# EAGLE design PCB_MOTEUR_V0_2b (EAGLE 9.5.2)
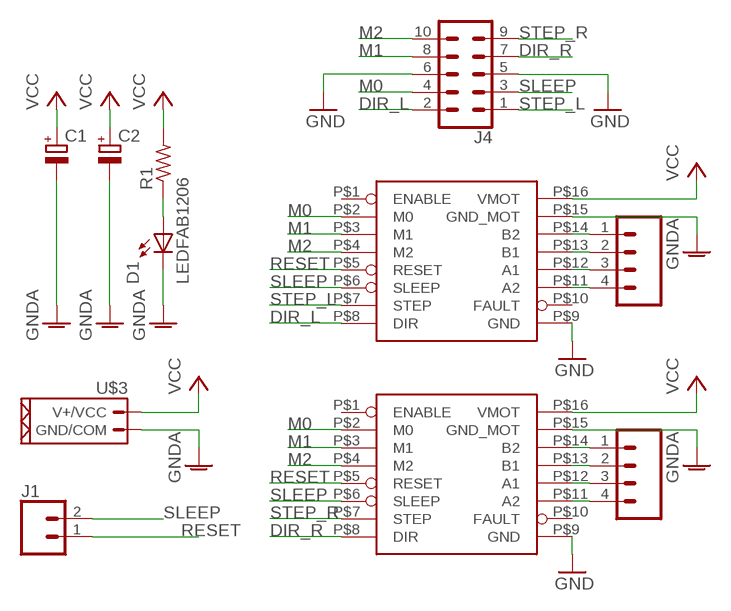
[diagram p0: schematic, sheet 1]

## Parts
C1  CPOL-EUE3.5-8  [E3,5-8]
C2  CPOL-EUE3.5-8  [E3,5-8]
D1  LEDFAB1206  [LED1206FAB]
J1  CONN_02  [1X02]
J3  CONN_04POLAR  [MOLEX-1X4]
J4  CONN_05X2SHD  [2X5-SHROUDED]
J5  CONN_04POLAR  [MOLEX-1X4]
R1  RES-US1206FAB  [R1206FAB]
U$1  DRV8825  [DRIVER_CARRIER_POLOLU_16]
U$2  DRV8825  [DRIVER_CARRIER_POLOLU_16]
U$3  CONN_02_PUIXT30  [XT30_FEMALE]

## Nets
DIR_L: J4.2 U$1.P$8(DIR)
DIR_R: J4.7 U$2.P$8(DIR)
GND: J4.5 J4.6 U$1.P$9(GND) U$2.P$9(GND)
GNDA: C1.- C2.- D1.2(C) U$1.P$15(GND_MOT) U$2.P$15(GND_MOT) U$3.P$2(GND/COM)
M0: J4.4 U$1.P$2(M0) U$2.P$2(M0)
M1: J4.8 U$1.P$3(M1) U$2.P$3(M1)
M2: J4.10 U$1.P$4(M2) U$2.P$4(M2)
N$1: J3.1 U$1.P$14(B2)
N$2: J3.2 U$1.P$13(B1)
N$3: J3.3 U$1.P$12(A1)
N$4: J3.4 U$1.P$11(A2)
N$5: D1.1(A) R1.1
N$7: J5.1 U$2.P$14(B2)
N$8: J5.2 U$2.P$13(B1)
N$9: J5.3 U$2.P$12(A1)
N$14: J5.4 U$2.P$11(A2)
RESET: J1.1 U$1.P$5(RESET) U$2.P$5(RESET)
SLEEP: J1.2 J4.3 U$1.P$6(SLEEP) U$2.P$6(SLEEP)
STEP_L: J4.1 U$1.P$7(STEP)
STEP_R: J4.9 U$2.P$7(STEP)
VCC: C1.+ C2.+ R1.2 U$1.P$16(VMOT) U$2.P$16(VMOT) U$3.P$1(V+/VCC)
Unconnected: U$1.P$1(ENABLE) U$1.P$10(FAULT) U$2.P$1(ENABLE) U$2.P$10(FAULT)

## Library data of the parts
C1 C2 = rcl:CPOL-EU: POLARIZED CAPACITOR, European symbol; SPICEPREFIX: C
D1 = fab:LED: LED
J1 = OPENBOT:CONN_02: Multi connection point. Often used as Generic Header-pin footprint for 0.1 inch spaced/style header connections On any of the 0.1 inch spaced packages, you can populate with these: Break Away Headers - Straight <https://www.sparkfun.com/products/116> (PRT-00116) Break Away Male Headers - Right Angle <https://www.sparkfun.com/products/553> (PRT-00553) Female Headers <https://www.sparkfun.com/products/115> (PRT-00115) Break Away Headers - Machine Pin <https://www.sparkfun.com/products/117> (PRT-00117) Break Away Female Headers - Swiss Machine Pin <https://www.sparkfun.com/products/743> (PRT-00743) For SCREWTERMINALS and SPRING TERMINALS visit here: Screw Terimnals on SparkFun.com <https://www.sparkfun.com/search/results?term=Screw+Terminals> (5mm/3.5mm/2.54mm spacing) This device is also useful as a general connection point to wire up your design to another part of your project. Our various solder wires solder well into these plated through hole pads. Hook-Up Wire - Assortment (Stranded, 22 AWG) <https://www.sparkfun.com/products/11375> (PRT-11375) Hook-Up Wire - Assortment (Solid Core, 22 AWG) <https://www.sparkfun.com/products/11367> (PRT-11367) View the entire wire category on our website here <https://www.sparkfun.com/categories/141> Special notes: Molex polarized connector foot print use with: PRT-08233 with associated crimp pins and housings. 2.54_SCREWTERM for use with PRT-10571. 3.5mm Screw Terminal footprints for PRT-08084 5mm Screw Terminal footprints for use with PRT-08432 Multi connection point. Often used as Generic Header-pin footprint for 0.1 inch spaced/style header connections On any of the 0.1 inch spaced packages, you can populate with these: Break Away Headers - Straight <https://www.sparkfun.com/products/116> (PRT-00116) Break Away Male Headers - Right Angle <https://www.sparkfun.com/products/553> (PRT-00553) Female Headers <https://www.sparkfun.com/products/115> (PRT-00115) Break Away Headers - Machine Pin <https://www.sparkfun.com/products/117> (PRT-00117) Break Away Female Headers - Swiss Machine Pin <https://www.sparkfun.com/products/743> (PRT-00743) For SCREWTERMINALS and SPRING TERMINALS visit here: Screw Terimnals on SparkFun.com <https://www.sparkfun.com/search/results?term=Screw+Terminals> (5mm/3.5mm/2.54mm spacing) This device is also useful as a general connection point to wire up your design to another part of your project. Our various solder wires solder well into these plated through hole pads. Hook-Up Wire - Assortment (Stranded, 22 AWG) <https://www.sparkfun.com/products/11375> (PRT-11375) Hook-Up Wire - Assortment (Solid Core, 22 AWG) <https://www.sparkfun.com/products/11367> (PRT-11367) View the entire wire category on our website here <https://www.sparkfun.com/categories/141> Special notes: Molex polarized connector foot print use with: PRT-08233 with associated crimp pins and housings. 2.54_SCREWTERM for use with PRT-10571. 3.5mm Screw Terminal footprints for PRT-08084 5mm Screw Terminal footprints for use with PRT-08432
J3 J5 = OPENBOT:CONN_04: Multi connection point. Often used as Generic Header-pin footprint for 0.1 inch spaced/style header connections On any of the 0.1 inch spaced packages, you can populate with these: Break Away Headers - Straight <https://www.sparkfun.com/products/116> (PRT-00116) Break Away Male Headers - Right Angle <https://www.sparkfun.com/products/553> (PRT-00553) Female Headers <https://www.sparkfun.com/products/115> (PRT-00115) Break Away Headers - Machine Pin <https://www.sparkfun.com/products/117> (PRT-00117) Break Away Female Headers - Swiss Machine Pin <https://www.sparkfun.com/products/743> (PRT-00743) For SCREWTERMINALS and SPRING TERMINALS visit here: Screw Terimnals on SparkFun.com <https://www.sparkfun.com/search/results?term=Screw+Terminals> (5mm/3.5mm/2.54mm spacing) This device is also useful as a general connection point to wire up your design to another part of your project. Our various solder wires solder well into these plated through hole pads. Hook-Up Wire - Assortment (Stranded, 22 AWG) <https://www.sparkfun.com/products/11375> (PRT-11375) Hook-Up Wire - Assortment (Solid Core, 22 AWG) <https://www.sparkfun.com/products/11367> (PRT-11367) View the entire wire category on our website here <https://www.sparkfun.com/categories/141> Special notes: Molex polarized connector foot print use with SKU : PRT-08231 with associated crimp pins and housings. 1MM SMD Version SKU: PRT-10208 Multi connection point. Often used as Generic Header-pin footprint for 0.1 inch spaced/style header connections On any of the 0.1 inch spaced packages, you can populate with these: Break Away Headers - Straight <https://www.sparkfun.com/products/116> (PRT-00116) Break Away Male Headers - Right Angle <https://www.sparkfun.com/products/553> (PRT-00553) Female Headers <https://www.sparkfun.com/products/115> (PRT-00115) Break Away Headers - Machine Pin <https://www.sparkfun.com/products/117> (PRT-00117) Break Away Female Headers - Swiss Machine Pin <https://www.sparkfun.com/products/743> (PRT-00743) For SCREWTERMINALS and SPRING TERMINALS visit here: Screw Terimnals on SparkFun.com <https://www.sparkfun.com/search/results?term=Screw+Terminals> (5mm/3.5mm/2.54mm spacing) This device is also useful as a general connection point to wire up your design to another part of your project. Our various solder wires solder well into these plated through hole pads. Hook-Up Wire - Assortment (Stranded, 22 AWG) <https://www.sparkfun.com/products/11375> (PRT-11375) Hook-Up Wire - Assortment (Solid Core, 22 AWG) <https://www.sparkfun.com/products/11367> (PRT-11367) View the entire wire category on our website here <https://www.sparkfun.com/categories/141> Special notes: Molex polarized connector foot print use with SKU : PRT-08231 with associated crimp pins and housings. 1MM SMD Version SKU: PRT-10208; PROD_ID: CONN-08186; SF_ID: PRT-08231
J4 = OPENBOT:CONN_05X2: Multi connection point. Often used as Generic Header-pin footprint for 0.1 inch spaced/style header connections For AVR SPI programming port, see special device with nice symbol: "AVR_SPI_PROG_5x2.dev" You can populate with any combo of single row headers, but if you'd like an exact match, check these: 2x5 AVR ICSP Male Header <https://www.sparkfun.com/products/778> (PRT-00778) 2x5 Pin Shrouded Header <https://www.sparkfun.com/products/8506> (PRT-08506) On any of the 0.1 inch spaced packages, you can populate with these: Break Away Headers - Straight <https://www.sparkfun.com/products/116> (PRT-00116) Break Away Male Headers - Right Angle <https://www.sparkfun.com/products/553> (PRT-00553) Female Headers <https://www.sparkfun.com/products/115> (PRT-00115) Break Away Headers - Machine Pin <https://www.sparkfun.com/products/117> (PRT-00117) Break Away Female Headers - Swiss Machine Pin <https://www.sparkfun.com/products/743> (PRT-00743) Special note: the shrouded connector mates well with our 5x2 ribbon cables: 2x5 Pin IDC Ribbon Cable <https://www.sparkfun.com/products/8535> (PRT-08535); PROD_ID: CONN-08671; SF_ID: PRT-08506
R1 = fab:RES-US: Resistor (US Symbol) Variants with postfix FAB are widened to allow the routing of internal traces
U$1 U$2 = KARIBOUS:DRV8825
U$3 = OPENBOT:CONN_02_PUI

## Board
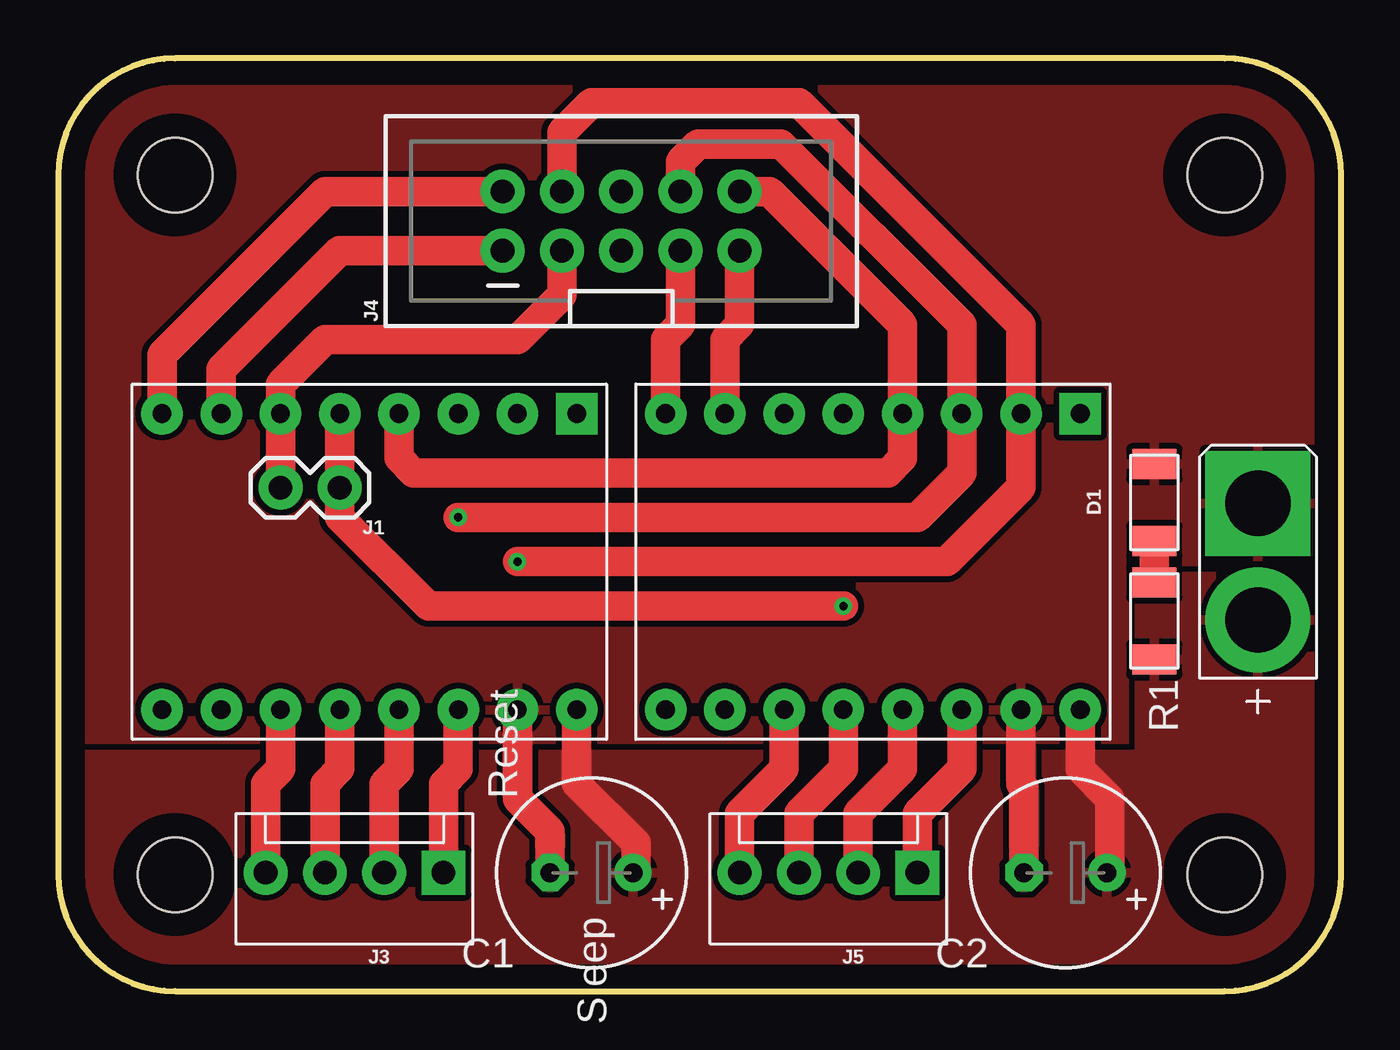
[diagram p1: board, top side]
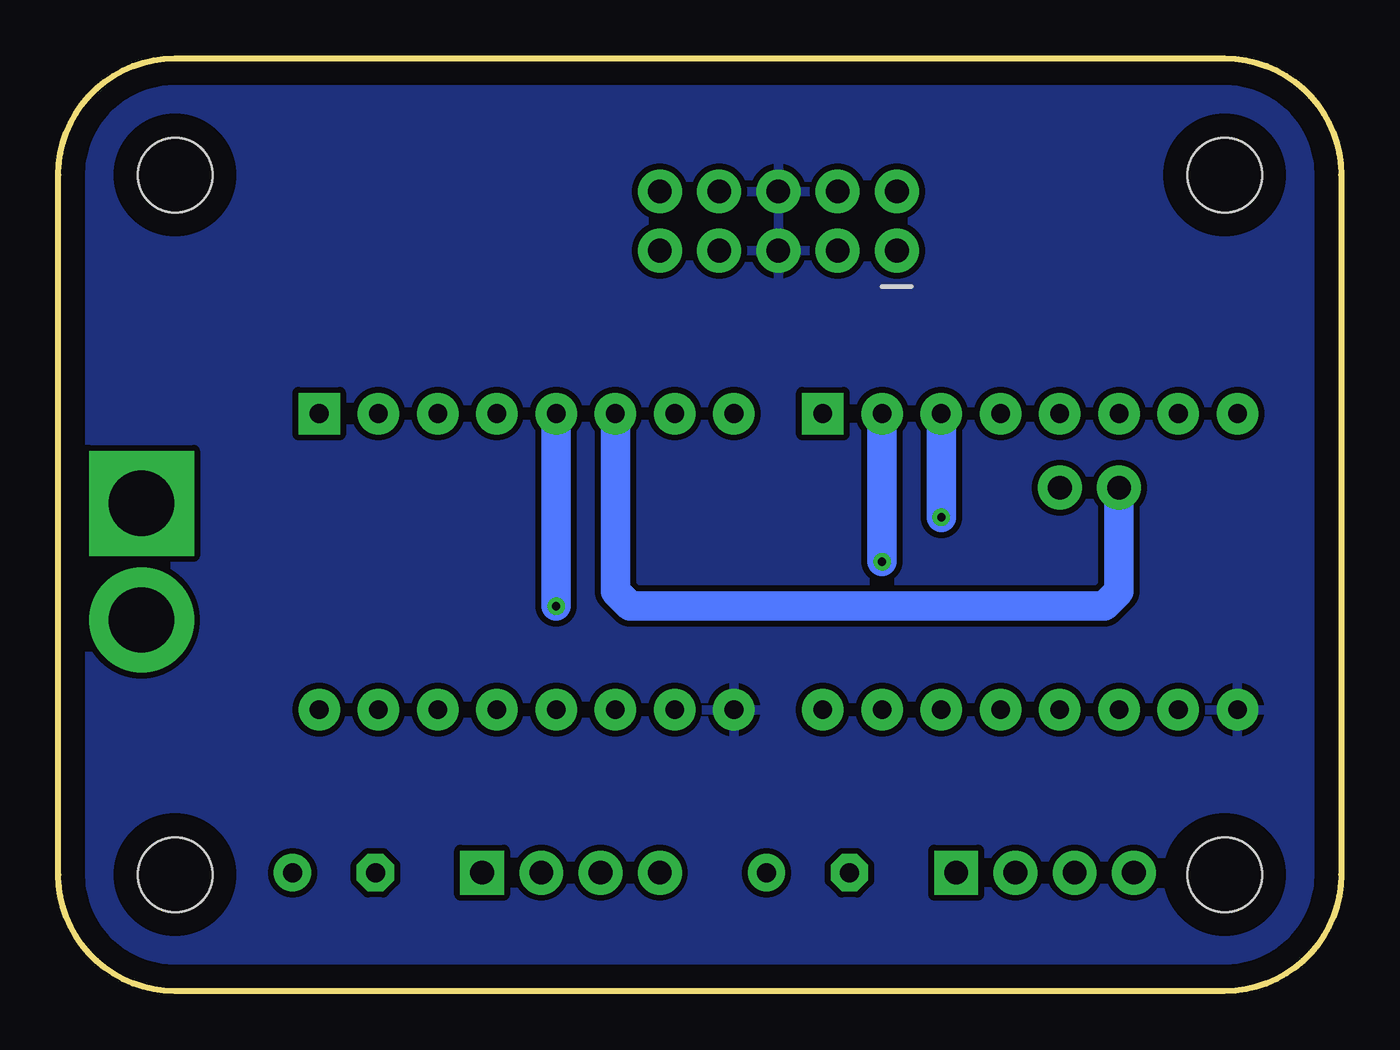
[diagram p2: board, bottom side, seen from below]

Size 55 x 40 mm. Coordinates in mm from the lower left corner, seen from the top.
Outline: 5,0 50,0 arc90 55,5 55,35 arc90 50,40 5,40 arc90 0,35 0,5 arc90 5,0
Copper layers (1*16): Top 0.035mm / dielectric 1.5mm / Bottom 0.035mm
Design rules "default *": minimum track width 6mil, minimum drill 0.35mm, track to track 10mil, track to pad 6mil, pad to pad 6mil, via to via 6mil, smd to smd 6mil, copper to edge 40mil, drill to drill 6mil, minimum pad ring 10mil, minimum via ring 8mil, stop-mask expansion 4mil, vias tented up to drill 0mil, thermal gap 10mil
Holes 3.2 mm at 5,35 5,5 50,35 50,5

### Footprints (pad centres in the part's own frame; a part is rotated, then mirrored left to right if it is on the bottom)
E3,5-8 = drill 0.813 pad 1.6: + -1.778,0 | drill 0.813 pad 1.6 octagon: - 1.778,0
LED1206FAB = smd 1.27 x 1.905: 1 -1.651,0; 2 1.651,0
1X02 = drill 1.016 pad 1.88: 1 0,0; 2 2.54,0
MOLEX-1X4 = drill 1.016 pad 1.88 square: 1 0,0 | drill 1.016 pad 1.88: 2 2.54,0; 3 5.08,0; 4 7.62,0
2X5-SHROUDED = drill 1.016 pad 1.88: 1 -1.27,5.08; 2 1.27,5.08; 3 -1.27,2.54; 4 1.27,2.54; 5 -1.27,0; 6 1.27,0; 7 -1.27,-2.54; 8 1.27,-2.54; 9 -1.27,-5.08; 10 1.27,-5.08
R1206FAB = smd 1.27 x 1.905: 1 -1.651,0; 2 1.651,0
DRIVER_CARRIER_POLOLU_16 = drill 0.8 pad 1.778 square: P$1 0,0 | drill 0.8 pad 1.778: P$2 0,-2.54; P$3 0,-5.08; P$4 0,-7.62; P$5 0,-10.16; P$6 0,-12.7; P$7 0,-15.24; P$8 0,-17.78; P$9 12.7,-17.78; P$10 12.7,-15.24; P$11 12.7,-12.7; P$12 12.7,-10.16; P$13 12.7,-7.62; P$14 12.7,-5.08; P$15 12.7,-2.54; P$16 12.7,0
XT30_FEMALE = drill 2.8 pad 4.5: P$1 -2.5,0 | drill 2.8 pad 4.5 square: P$2 2.5,0

### Placement (x,y rotation side)
C1  22.86,5.08 180 top
C2  43.18,5.08 180 top
D1  46.99,20.95 90 top
J1  12.06,21.59 180 top
J3  16.51,5.08 180 top
J4  24.13,33.02 90 top
J5  36.83,5.08 180 top
R1  46.99,15.88 270 top
U$1  22.23,24.77 270 top
U$2  43.81,24.77 270 top
U$3  51.44,18.41 90 top

### Tracks (layer width: path | path; a pad name or v marks a point on that pad's centre or on a via)
DIR_L
  Top 1.27: J4.2 11.43,34.29 4.45,27.3 U$1.P$8
DIR_R
  Top 1.27: U$2.P$8 26.04,27.94 26.67,28.57 J4.7
GND
  pour Bottom: -0.64,41.27 56.52,41.27 57.15,40.64 57.15,-1.27 0,-1.27 -0.64,-0.64
GNDA
  Top 1.27: C1.- 21.08,6.86 19.68,8.26 U$1.P$15 | C2.- 41.4,8.76 41.27,8.89 U$2.P$15
  pour Top (rank 3): -0.64,41.27 56.52,41.27 56.52,-0.64 -0.64,-0.64
M0  (via drill 0.35)
  Top 1.27: J4.4 21.59,36.83 22.86,38.1 31.75,38.1 41.27,28.57 U$2.P$2 41.27,21.59 38.1,18.41 v19.68,18.41
  Bottom 1.27: U$1.P$2 v19.68,18.41
M1  (via drill 0.35)
  Top 1.27: J4.8 26.67,35.56 27.43,36.32 30.99,36.32 38.73,28.57 U$2.P$3 38.73,22.23 36.83,20.32 v17.14,20.32
  Bottom 1.27: U$1.P$3 v17.14,20.32
M2
  Top 1.27: J4.10 30.48,34.29 36.2,28.57 U$2.P$4 36.2,22.86 35.56,22.23 15.24,22.23 14.61,22.86 U$1.P$4
N$1
  Top 1.27: U$1.P$14 17.14,9.53 16.51,8.89 J3.1
N$2
  Top 1.27: U$1.P$13 14.61,9.53 13.97,8.89 J3.2
N$3
  Top 1.27: U$1.P$12 12.06,9.53 11.43,8.89 J3.3
N$4
  Top 1.27: U$1.P$11 9.53,9.53 8.89,8.89 J3.4
N$5
  Top 1.27: D1.1 R1.1
N$7
  Top 1.27: J5.1 36.83,7.62 38.73,9.53 U$2.P$14
N$8
  Top 1.27: J5.2 34.29,7.62 36.2,9.53 U$2.P$13
N$9
  Top 1.27: J5.3 31.75,7.62 33.66,9.53 U$2.P$12
N$14
  Top 1.27: J5.4 29.21,7.62 31.11,9.53 U$2.P$11
RESET  (via drill 0.35)
  Top 1.27: U$1.P$5 J1.1 12.06,20.32 15.88,16.51 v33.66,16.51
  Bottom 1.27: U$2.P$5 v33.66,16.51
SLEEP
  Top 1.27: J1.2 U$1.P$6 9.53,26.04 11.43,27.94 19.68,27.94 21.59,29.84 J4.3
  Bottom 1.27: U$2.P$6 31.11,17.14 30.48,16.51 10.16,16.51 9.53,17.14 J1.2
STEP_L
  Top 1.27: U$1.P$7 6.99,26.67 12.06,31.75 J4.1
STEP_R
  Top 1.27: U$2.P$7 28.57,27.94 29.21,28.57 J4.9
VCC
  Top 1.27: U$1.P$16 22.23,8.89 24.77,6.35 24.77,5.21 C1.+ | U$2.P$16 43.81,9.53 45.09,8.26 45.09,5.21 C2.+
  pour Top (rank 2): 0,10.16 46.35,10.16 46.35,17.78 54.61,17.78 55.24,17.78 55.24,-0.64 0,-0.64

### Text on the board
tNames: Reset | Sleep